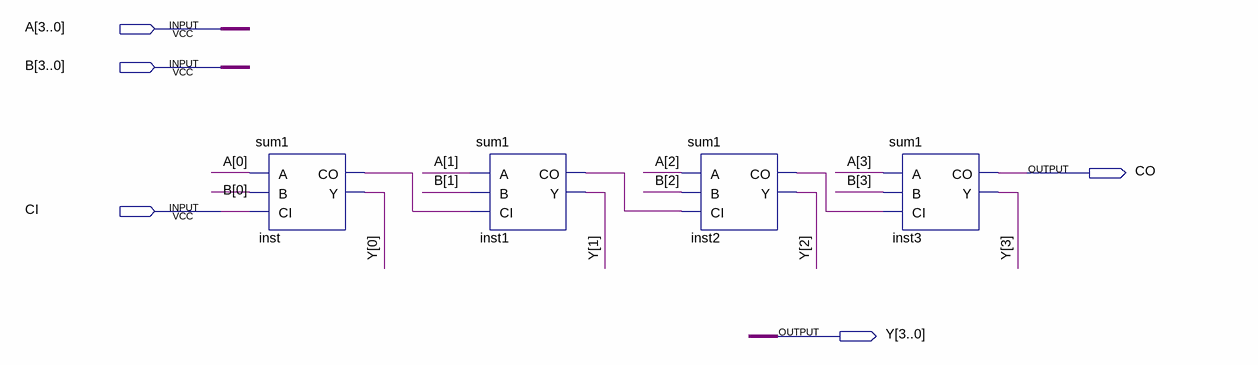
[diagram p0: schematic sheet]
// Quartus schematic sum4.bdf as structural Verilog: 4 symbols, 5 pins
module sum4 (
  input  [3:0] A,
  input  [3:0] B,
  input  CI,
  output CO,
  output [3:0] Y
);

  wire inst1_co, inst2_co, inst_co;

  sum1 inst (.A(A[0]), .B(B[0]), .CI(CI), .CO(inst_co), .Y(Y[0]));
  sum1 inst1 (.A(A[1]), .B(B[1]), .CI(inst_co), .CO(inst1_co), .Y(Y[1]));
  sum1 inst2 (.A(A[2]), .B(B[2]), .CI(inst1_co), .CO(inst2_co), .Y(Y[2]));
  sum1 inst3 (.A(A[3]), .B(B[3]), .CI(inst2_co), .CO(CO), .Y(Y[3]));
endmodule
